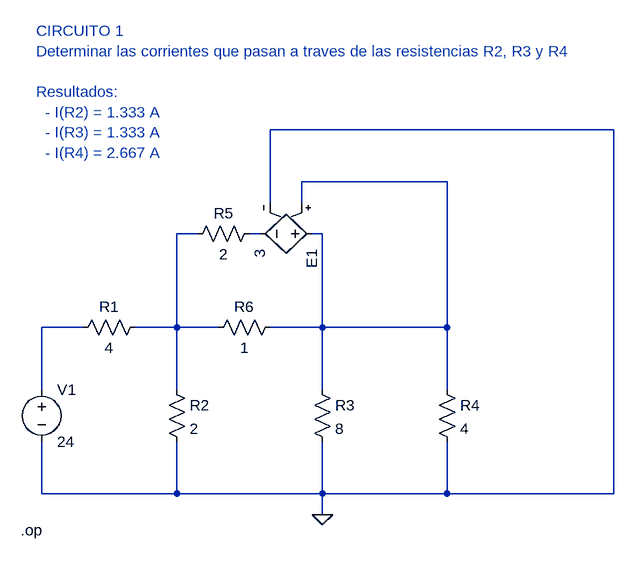
[diagram p0: schematic circuito1.asc]
circuito1.asc, the LTspice schematic file:
Version 4
SHEET 1 1188 680
WIRE 848 -496 320 -496
WIRE 592 -416 368 -416
WIRE 320 -384 320 -496
WIRE 368 -384 368 -416
WIRE 208 -336 176 -336
WIRE 304 -336 288 -336
WIRE 400 -336 384 -336
WIRE 32 -192 -32 -192
WIRE 176 -192 176 -336
WIRE 176 -192 112 -192
WIRE 240 -192 176 -192
WIRE 400 -192 400 -336
WIRE 400 -192 320 -192
WIRE 592 -192 592 -416
WIRE 592 -192 400 -192
WIRE -32 -96 -32 -192
WIRE 176 -96 176 -192
WIRE 400 -96 400 -192
WIRE 592 -96 592 -192
WIRE -32 64 -32 -16
WIRE 176 64 176 -16
WIRE 176 64 -32 64
WIRE 400 64 400 -16
WIRE 400 64 176 64
WIRE 592 64 592 -16
WIRE 592 64 400 64
WIRE 848 64 848 -496
WIRE 848 64 592 64
WIRE 400 96 400 64
FLAG 400 96 0
SYMBOL e 400 -336 R90
SYMATTR InstName E1
SYMATTR Value 3
SYMBOL res 16 -176 R270
WINDOW 0 32 56 VTop 2
WINDOW 3 0 56 VBottom 2
SYMATTR InstName R1
SYMATTR Value 4
SYMBOL res 160 -112 R0
SYMATTR InstName R2
SYMATTR Value 2
SYMBOL res 384 -112 R0
SYMATTR InstName R3
SYMATTR Value 8
SYMBOL res 576 -112 R0
SYMATTR InstName R4
SYMATTR Value 4
SYMBOL res 304 -352 R90
WINDOW 0 0 56 VBottom 2
WINDOW 3 32 56 VTop 2
SYMATTR InstName R5
SYMATTR Value 2
SYMBOL res 336 -208 R90
WINDOW 0 0 56 VBottom 2
WINDOW 3 32 56 VTop 2
SYMATTR InstName R6
SYMATTR Value 1
SYMBOL voltage -32 -112 R0
WINDOW 123 0 0 Left 0
WINDOW 39 0 0 Left 0
SYMATTR InstName V1
SYMATTR Value 24
TEXT -64 120 Left 2 !.op
TEXT -40 -648 Left 2 ;CIRCUITO 1\nDeterminar las corrientes que pasan a traves de las resistencias R2, R3 y R4\n \nResultados:\n  - I(R2) = 1.333 A\n  - I(R3) = 1.333 A\n  - I(R4) = 2.667 A

The netlist it stands for:
* circuito1.asc
E1 N001 N003 N001 0 3
R1 N004 N002 4
R2 N002 0 2
R3 N001 0 8
R4 N001 0 4
R5 N003 N002 2
R6 N001 N002 1
V1 N004 0 24
.op
* CIRCUITO 1
* Determinar las corrientes que pasan a traves de las resistencias R2, R3 y R4
* Resultados:
*   - I(R2) = 1.333 A
*   - I(R3) = 1.333 A
*   - I(R4) = 2.667 A
.backanno
.end